# EAGLE design Adafruit BNO055 and BMP280 BFF (EAGLE 9.6.2)
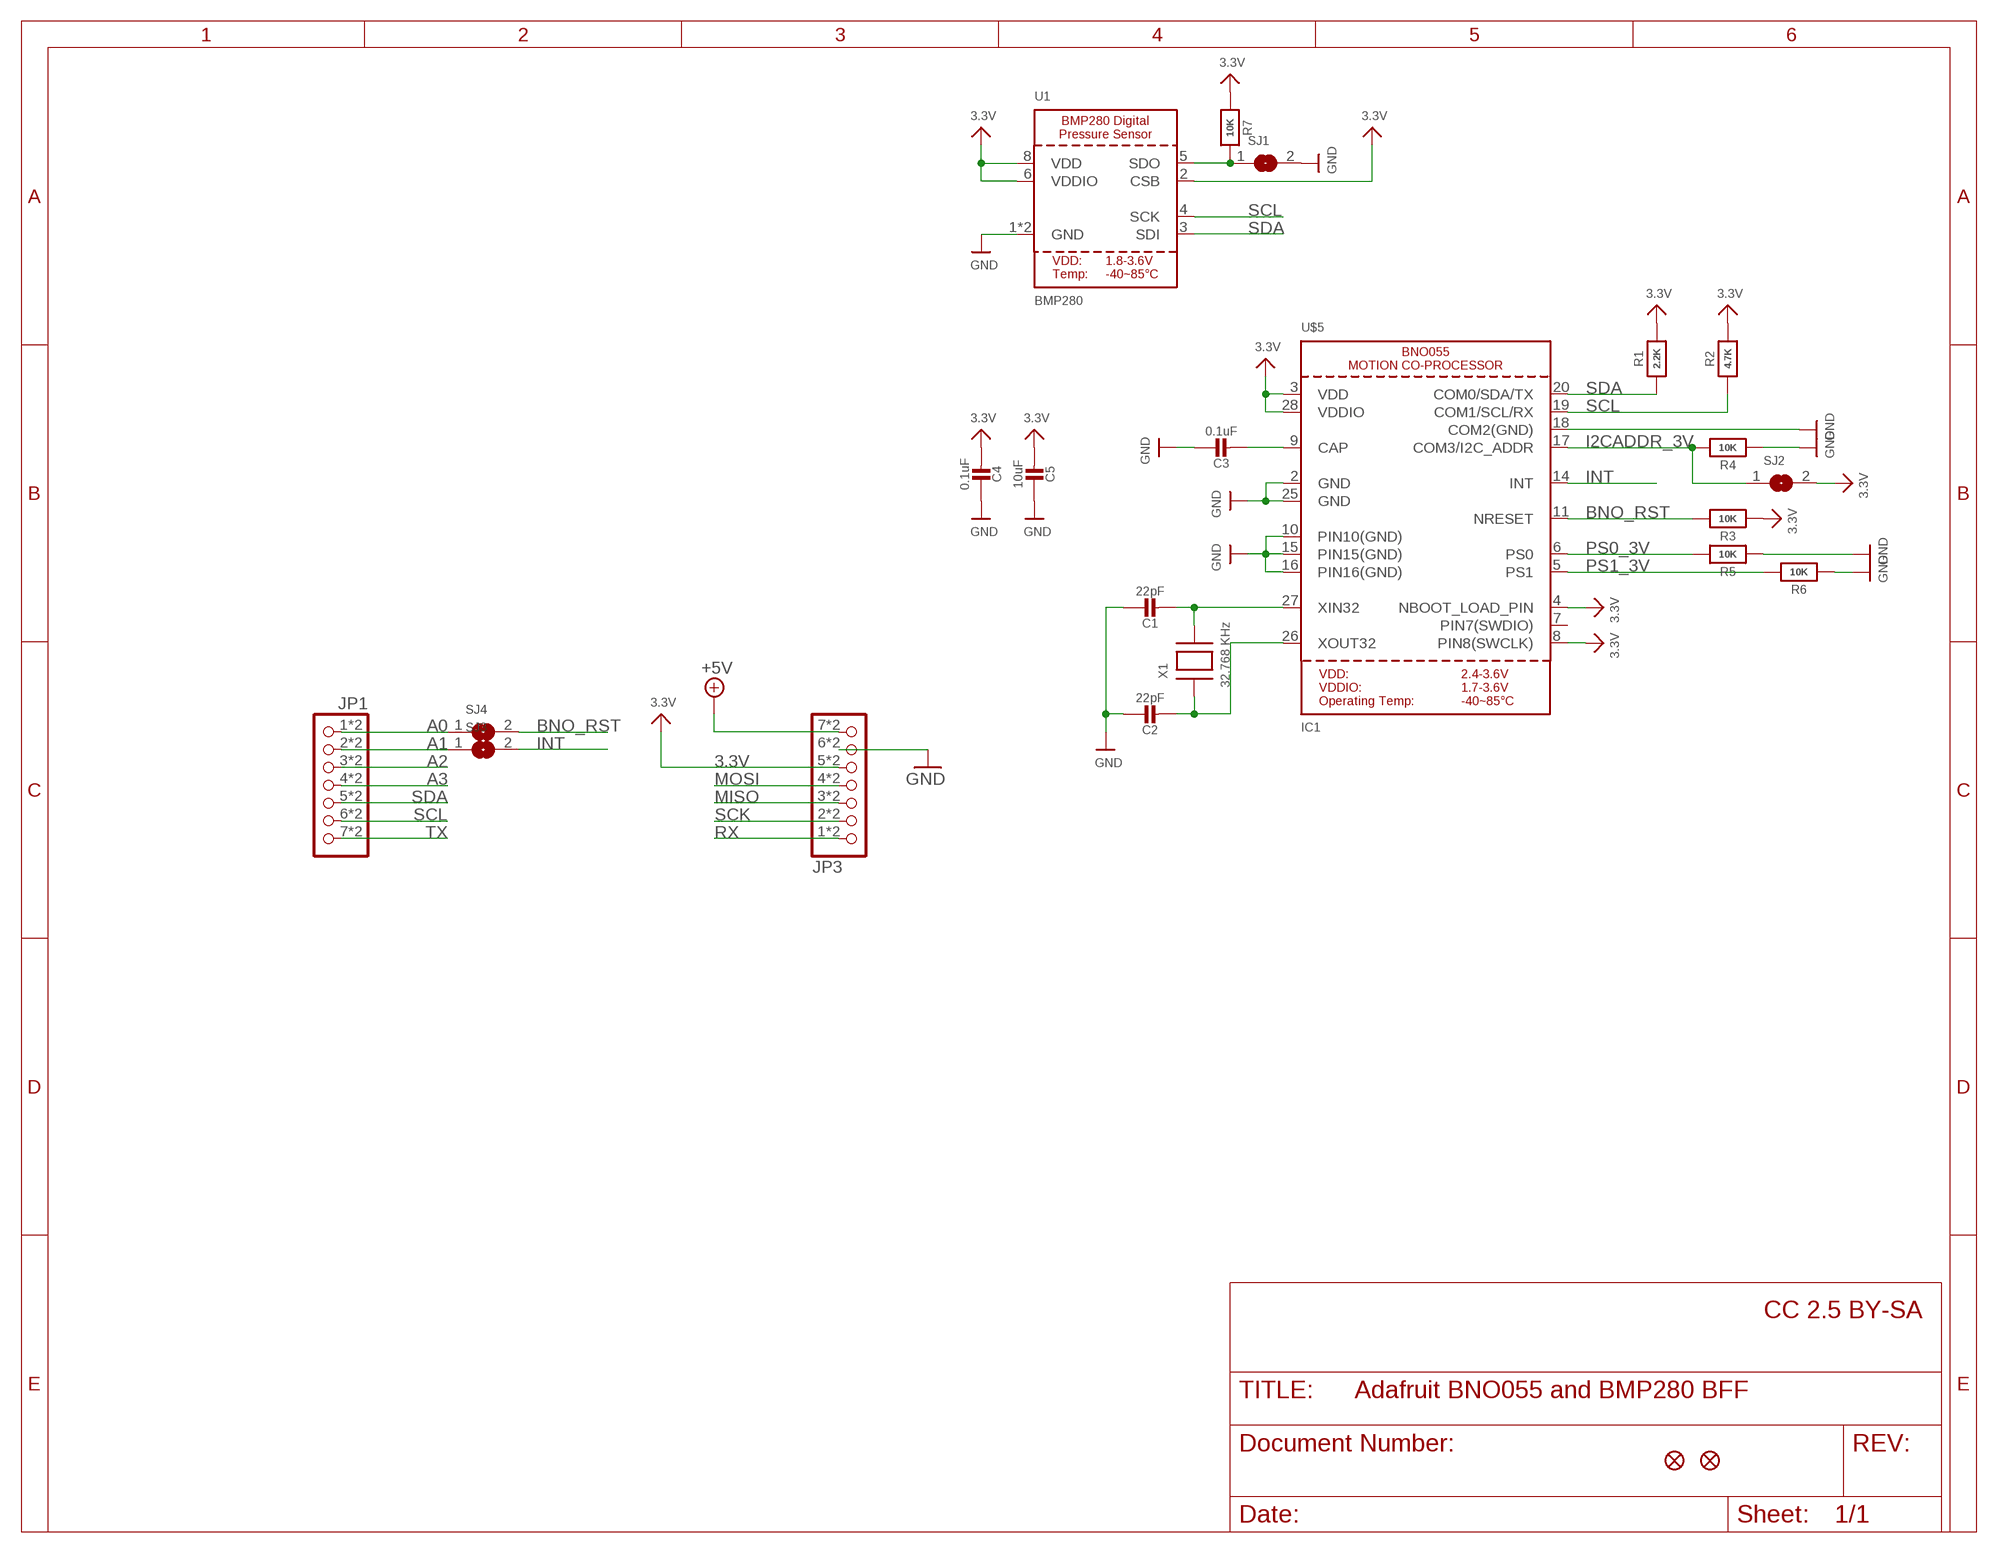
[diagram p0: schematic, sheet 1]

## Parts
C1  22pF  CAP_CERAMIC0603_NO  [0603-NO]
C2  22pF  CAP_CERAMIC0603_NO  [0603-NO]
C3  0.1uF  CAP_CERAMIC0603_NO  [0603-NO]
C4  0.1uF  CAP_CERAMIC0603_NO  [0603-NO]
C5  10uF  CAP_CERAMIC0805-NOOUTLINE  [0805-NO]
JP1  HEADER-1X7_CASTEL  [1X07_CASTEL]
JP3  HEADER-1X7_CASTEL  [1X07_CASTEL]
R1  2.2K  RESISTOR_0603_NOOUT  [0603-NO]
R2  4.7K  RESISTOR_0603_NOOUT  [0603-NO]
R3  10K  RESISTOR_0603_NOOUT  [0603-NO]
R4  10K  RESISTOR_0603_NOOUT  [0603-NO]
R5  10K  RESISTOR_0603_NOOUT  [0603-NO]
R6  10K  RESISTOR_0603_NOOUT  [0603-NO]
R7  10K  RESISTOR_0603_NOOUT  [0603-NO]
SJ1  SOLDERJUMPER  [SOLDERJUMPER_ARROW_NOPASTE]
SJ2  SOLDERJUMPER  [SOLDERJUMPER_ARROW_NOPASTE]
SJ3  SOLDERJUMPER  [SOLDERJUMPER_ARROW_NOPASTE]
SJ4  SOLDERJUMPER  [SOLDERJUMPER_ARROW_NOPASTE]
U1  BMP280  [BMP280]
U$5  IC1  BNO055  [BNO055]
U$6  FIDUCIAL_0.5MM  [FIDUCIAL_0.5MM]
U$8  FIDUCIAL_0.5MM  [FIDUCIAL_0.5MM]
X1  32.768 KHz  XTAL-3.2X1.5  [XTAL3215]

## Nets
3.3V: C4.2 C5.2 JP3.5 JP3.5C R1.2 R2.2 R3.1 R7.1 SJ2.2 U1.2(CSB) U1.6(VDDIO) U1.8(VDD) U$5.3(VDD) U$5.4(NBOOT_LOAD_PIN) U$5.8(PIN8(SWCLK)) U$5.28(VDDIO)
+5V [highpower]: JP3.7 JP3.7C
A0: JP1.1 JP1.1C SJ4.1
A1: JP1.2 JP1.2C SJ3.1
A2: JP1.3 JP1.3C
A3: JP1.4 JP1.4C
BNO_RST: R3.2 SJ4.2 U$5.11(NRESET)
GND [highpower]: C1.1 C2.1 C3.1 C4.1 C5.1 JP3.6 JP3.6C R4.1 R5.1 R6.1 SJ1.2 U1.1(GND) U1.7(GND) U$5.2(GND) U$5.10(PIN10(GND)) U$5.15(PIN15(GND)) U$5.16(PIN16(GND)) U$5.18(COM2(GND)) U$5.25(GND)
I2CADDR_3V: R4.2 SJ2.1 U$5.17(COM3/I2C_ADDR)
INT: SJ3.2 U$5.14(INT)
MISO: JP3.3 JP3.3C
MOSI: JP3.4 JP3.4C
N$1: C1.2 U$5.27(XIN32) X1.P$2
N$2: C2.2 U$5.26(XOUT32) X1.P$1
N$3: C3.2 U$5.9(CAP)
N$4: R7.2 SJ1.1 U1.5(SDO)
PS0_3V: R5.2 U$5.6(PS0)
PS1_3V: R6.2 U$5.5(PS1)
RX: JP3.1 JP3.1C
SCK: JP3.2 JP3.2C
SCL: JP1.6 JP1.6C R2.1 U1.4(SCK) U$5.19(COM1/SCL/RX)
SDA: JP1.5 JP1.5C R1.1 U1.3(SDI) U$5.20(COM0/SDA/TX)
TX: JP1.7 JP1.7C
Unconnected: U$5.7(PIN7(SWDIO))

## Notes on the sheet
- CC 2.5 BY-SA

## Library data of the parts
C1-C5 = microbuilder:CAP_CERAMIC: Ceramic Capacitors For new designs, use the packages preceded by an '_' character since they are more reliable: The following footprints should be used on most boards: _0402 - Standard footprint for regular board layouts _0603 - Standard footprint for regular board layouts _0805 - Standard footprint for regular board layouts _1206 - Standard footprint for regular board layouts For extremely tight-pitch boards where space is at a premium, the following 'micro-pitch' footprints can be used (smaller pads, no silkscreen outline, etc.): _0402MP - Micro-pitch footprint for very dense/compact boards _0603MP - Micro-pitch footprint for very dense/compact boards _0805MP - Micro-pitch footprint for very dense/compact boards _1206MP - Micro-pitch footprint for very dense/compact boards
JP1 JP3 = adafruit_electromech:HEADER-1X7: PIN HEADER
R1-R7 = microbuilder:RESISTOR: Resistors For new designs, use the packages preceded by an '_' character since they are more reliable: The following footprints should be used on most boards: _0402 - Standard footprint for regular board layouts _0603 - Standard footprint for regular board layouts _0805 - Standard footprint for regular board layouts _1206 - Standard footprint for regular board layouts For extremely tight-pitch boards where space is at a premium, the following 'micro-pitch' footprints can be used (smaller pads, no silkscreen outline, etc.): _0402MP - Micro-pitch footprint for very dense/compact boards _0603MP - Micro-pitch footprint for very dense/compact boards _0805MP - Micro-pitch footprint for very dense/compact boards _1206MP - Micro-pitch footprint for very dense/compact boards
SJ1-SJ4 = microbuilder:SOLDERJUMPER: SMD Solder JUMPER Solder the two pads together to create a connection, or remove the solder to break it. REFLOW - Use this footprint for solder paste and reflow ovens. WAVE - Use this footprint for hand-soldering (larger pads). CLOSED - Has a trace between the two pads to ensure it is closed by default. The trace needs to be cut to disable the jumper, and can be closed again by creating a solder bridge between the two pads.; BOM: EXCLUDE
U1 = adafruit_sensor:BMP280: BMP280 - Digital Pressure Sensor Operating Pressure Range: 300-1100 hPa Pressure Resolution: 0.16Pa RMS Noise: 1.3Pa Temperature Resolution: 0.01 C
U$5 = adafruit_sensor:BNO055: BNO055 - Motion Co-Processor
U$6 U$8 = microbuilder:FIDUCIAL: Fiducial Alignment Points Various fiducial points for machine vision alignment.
X1 = adafruit2:XTAL: Low cost SMT crystals, no capacitors included http://www.ladyada.net/library/eagle

## Net classes
1 highpower: width 0.406 mm, drill 0.381 mm
2 thickpower: width 0.406 mm

## Board
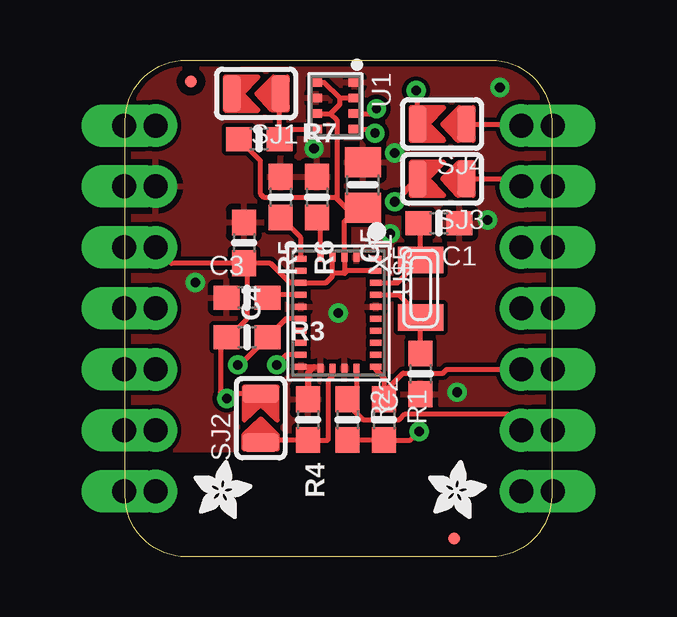
[diagram p1: board, top side]
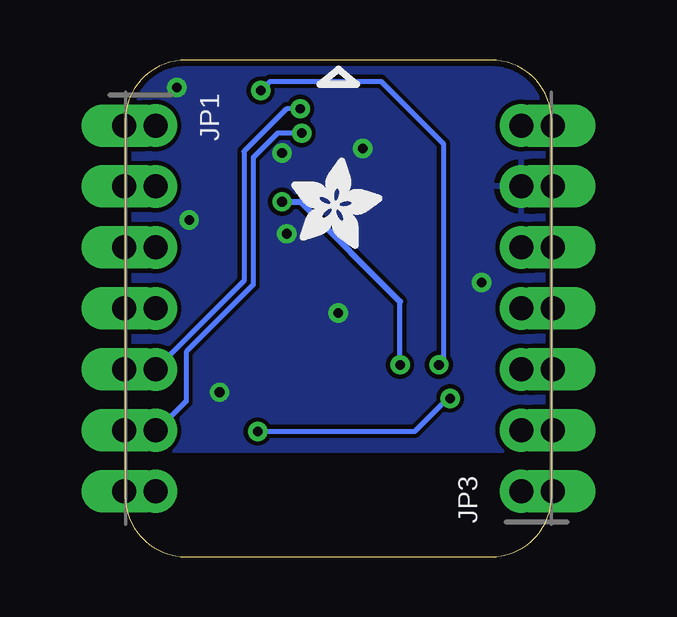
[diagram p2: board, bottom side, seen from below]

Size 17.78 x 20.7 mm. Coordinates in mm from the lower left corner, seen from the top.
Outline: 17.78,18.16 17.78,2.54 arc-90 15.24,0 2.54,0 arc-90 0,2.54 0,18.16 arc-90 2.54,20.7 15.24,20.7 arc-90 17.78,18.16
Copper layers (1*16): Top 0.035mm / dielectric 1.5mm / Bottom 0.035mm
Design rules "adafruit 7-7": minimum track width 7mil, minimum drill 15.5mil, track to track 7mil, track to pad 7mil, pad to pad 7mil, via to via 7mil, smd to smd 7mil, copper to edge 10mil, drill to drill 8mil, minimum pad ring 7mil, minimum via ring 8mil, stop-mask expansion 2mil, vias tented up to drill 20mil, thermal gap 10mil

### Footprints (pad centres in the part's own frame; a part is rotated, then mirrored left to right if it is on the bottom)
0603-NO = smd 1.075 x 1: 1 -0.85,0; 2 0.85,0
0805-NO = smd 1.24 x 1.5: 1 -0.95,0; 2 0.95,0
1X07_CASTEL = drill 1 pad 1.778: 1 -7.62,0; 2 -5.08,0; 3 -2.54,0; 4 0,0; 5 2.54,0; 6 5.08,0; 7 7.62,0 | drill 1 pad 1.778 long: 1C -7.62,-1.324; 2C -5.08,-1.324; 3C -2.54,-1.324; 4C 0,-1.324; 5C 2.54,-1.324; 6C 5.08,-1.324; 7C 7.62,-1.324
SOLDERJUMPER_ARROW_NOPASTE = smd 0.762 x 1.524: 1 -1.016,0; 2 1.016,0
BMP280 = smd 0.5 x 0.35: 1 0.8,0.975; 2 0.8,0.325; 3 0.8,-0.325; 4 0.8,-0.975; 5 -0.8,-0.975; 6 -0.8,-0.325; 7 -0.8,0.325; 8 -0.8,0.975
BNO055 = smd 0.25 x 0.475: 1 -2.25,1.562; 6 -2.25,-1.562; 7 -1.75,-1.562; 8 -1.25,-1.562; 9 -0.75,-1.562; 10 -0.25,-1.562; 11 0.25,-1.562; 12 0.75,-1.562; 13 1.25,-1.562; 14 1.75,-1.562; 15 2.25,-1.562; 20 2.25,1.562; 21 1.75,1.562; 22 1.25,1.562; 23 0.75,1.562; 24 0.25,1.562; 25 -0.25,1.562; 26 -0.75,1.562; 27 -1.25,1.562; 28 -1.75,1.562 | smd 0.375 x 0.25: 2 -2.312,0.75; 3 -2.312,0.25; 4 -2.312,-0.25; 5 -2.312,-0.75; 16 2.312,-0.75; 17 2.312,-0.25; 18 2.312,0.25; 19 2.312,0.75
FIDUCIAL_0.5MM = smd 0.5 x 0.5: 1 0,0
XTAL3215 = smd 1.1 x 1.9: P$1 1.2,0; P$2 -1.2,0

### Placement (x,y rotation side)
C1  13.08,13.91 180 top
C2  12.32,7.62 90 top
C3  5.08,10.79 0 top
C4  4.95,13.08 270 top
C5  9.91,15.49 270 top
JP1  16.51,10.35 270 bottom
JP3  1.27,10.35 90 bottom
PLABEL0  [PLABEL0]  13.59,19.75 0 top
PLABEL1  [PLABEL1]  11.11,15.88 0 top
PLABEL2  [PLABEL2]  8.83,2.03 0 top
PLABEL3  [PLABEL3]  2.98,17.97 90 top
PLABEL4  [PLABEL4]  2.98,15.37 0 top
PLABEL5  [PLABEL5]  3.3,12.89 0 top
PLABEL6  [PLABEL6]  2.92,10.22 90 top
PLABEL7  [PLABEL7]  3.24,7.81 0 top
PLABEL8  [PLABEL8]  2.92,5.14 90 top
PLABEL9  [PLABEL9]  2.16,1.08 0 top
PLABEL10  [PLABEL10]  15.56,1.08 0 top
PLABEL11  [PLABEL11]  14.16,5.08 0 top
PLABEL12  [PLABEL12]  14.8,7.81 90 top
PLABEL13  [PLABEL13]  14.48,10.41 0 top
PLABEL14  [PLABEL14]  14.48,12.64 0 top
PLABEL15  [PLABEL15]  8.89,9.14 0 bottom
PLABEL16  [PLABEL16]  9.02,18.1 0 bottom
PLABEL17  [PLABEL17]  9.08,2.92 0 bottom
R1  10.79,5.71 270 top
R2  9.27,5.71 270 top
R3  5.08,9.14 0 top
R4  7.62,5.71 270 top
R5  6.48,14.99 270 top
R6  8,14.99 270 top
R7  5.59,17.4 0 top
SJ1  5.46,19.3 180 top
SJ2  5.65,5.78 90 top
SJ3  13.21,15.75 180 top
SJ4  13.21,18.03 180 top
U1  8.76,18.8 0 top
U$2  [ADAFRUIT_3.5MM]  10.86,12.83 0 bottom
U$5  8.89,10.16 270 top
U$6  2.74,19.81 0 top
U$8  13.72,0.76 0 top
U$30  [ADAFRUIT_2.5MM]  12.64,1.59 0 top
U$31  [ADAFRUIT_2.5MM]  2.86,1.59 0 top
X1  12.32,11.18 270 top

### Tracks (layer width: path | path; a pad name or v marks a point on that pad's centre or on a via)
3.3V  (via drill 0.4)
  Top 0.203: C4.2 6.06,12.23 6.88,11.41 U$5.8 7.35,11.43 8.38,11.43 8.64,11.69 8.64,11.81 | 8.64,11.81 U$5.4 | 9.14,11.81 U$5.3 9.14,13.97 9.46,14.29 | 9.14,11.81 8.64,11.81 | U$5.28 9.24,11.91 9.14,11.81 | 9.46,14.29 9.65,14.48 9.27,14.48 8.83,14.92 | R2.2 R1.2 11.9,4.87 v12.26,5.22 | C4.2 5.08,12.1 5.08,9.91 4.32,9.14 R3.1 3.98,8.89 3.98,6.86 v4.23,6.6 4.42,6.79 SJ2.2 | C4.2 1.93,12.23 JP3.5 | U1.8 8.3,19.77 8.95,19.12 | 8.95,19.12 U1.2 | U1.6 8.56,18.47 | 8.95,19.12 8.95,18.85 8.56,18.47 | 8.56,18.47 8.83,18.21 8.83,14.92 | 8.83,14.92 8.76,14.99 5.78,14.99 5.63,15.14 5.63,16.51 R7.1 | C5.2 9.65,14.29 9.46,14.29
  Top 0.406: JP3.5C JP3.5
  Bottom 0.203: v12.26,5.22 5.7,5.22 4.27,6.65 v4.23,6.6
+5V
  Top 0.406: JP3.7C JP3.7
A0
  Top 0.203: SJ4.1 16.45,18.03 JP1.1
  Top 0.406: JP1.1C JP1.1
A1
  Top 0.203: SJ3.1 16.19,15.75 JP1.2
  Top 0.406: JP1.2C JP1.2
A2
  Top 0.406: JP1.3C JP1.3
A3
  Top 0.406: JP1.4C JP1.4
BNO_RST  (via drill 0.4)
  Top 0.203: U$5.11 6.7,9.91 R3.2 4.79,8 v4.7,8 | SJ4.2 12.19,19.37 v12.13,19.43
  Bottom 0.203: v12.13,19.43 11.75,19.81 7.11,19.81 4.51,17.21 4.51,8.26 4.73,8.03 v4.7,8
GND  (via drill 0.4)
  Top 0.203: U$5.15 7.87,7.91 8.08,7.91 U$5.16
  Top 0.254: 7.87,7.91 7.62,7.66 R4.1
  other vias: 8.89,10.16 11.05,13.46 7.87,17.02 2.92,11.43 13.84,6.86 15.11,14.03 15.62,19.56 11.24,16.83
  pour Top: 0,20.7 17.78,20.7 17.78,4.45 0,4.45
  pour Bottom: 0,20.7 17.78,20.7 17.78,4.45 0,4.45
I2CADDR_3V
  Top 0.203: U$5.17 8.64,7.53 8.45,7.34 8.45,4.87 R4.2 5.74,4.87 5.73,4.89 SJ2.1
INT  (via drill 0.4)
  Top 0.203: U$5.14 6.73,8.41 v6.32,8
  Top 0.254: SJ3.2 v11.24,14.8
  Bottom 0.203: v6.32,8 6.32,10.64
  Bottom 0.254: v11.24,14.8 10.48,14.8 6.32,10.64
MISO
  Top 0.406: JP3.3C JP3.3
MOSI
  Top 0.406: JP3.4C JP3.4
N$1
  Top 0.203: U$5.27 11.35,11.41 X1.P$2 12.32,13.56 C1.2
N$2
  Top 0.203: U$5.26 11.38,10.91 X1.P$1 C2.2
N$3
  Top 0.203: U$5.9 6.04,10.91 C3.2
N$4
  Top 0.203: U1.5 6.86,17.82 R7.2 6.44,18.88 6.48,18.92 SJ1.1
PS0_3V
  Top 0.203: U$5.6 7.33,13.29 R5.2
PS1_3V
  Top 0.203: U$5.5 8.14,14 R6.2
RX
  Top 0.406: JP3.1C JP3.1
SCK
  Top 0.406: JP3.2C JP3.2
SCL  (via drill 0.39)
  Top 0.203: U$5.19 9.64,6.93 R2.1 9.27,6.35 9.91,5.71 11.43,5.71 11.67,5.95 15.95,5.95 16.51,5.4 JP1.6 | U1.4 10.25,17.82 v10.41,17.65
  Top 0.406: JP1.6C JP1.6
  Bottom 0.203: v10.41,17.65 11.43,17.65 12.45,16.64 12.45,11.34 15.24,8.54 15.24,6.48 16.45,5.27 JP1.6
SDA  (via drill 0.39)
  Top 0.203: U$5.20 10.45,7.8 10.79,7.45 R1.1 10.79,6.86 11.59,7.65 13.25,7.65 13.41,7.81 16.38,7.81 JP1.5 | U1.3 10.22,18.47 10.41,18.67 v10.48,18.67
  Top 0.406: JP1.5C 16.38,7.81
  Bottom 0.203: v10.48,18.67 11.05,18.67 12.83,16.89 12.83,11.49 JP1.5
TX
  Top 0.406: JP1.7C JP1.7

### Text on the board
Pinguin_tBackup: RST | 5V | I | G | 3V | A2 | MO | A3 | MI | SDA | SCK | SCL | BNO055 / BMP280 | RX | TX
Pinguin_bBackup: USB | BNO055 / &BMP280 / QT Py BFF | Opt reset+IRQ / Addrs: 0x28,0x77 / w/addr jumpers